# EAGLE design ALU (EAGLE 9.5.2)
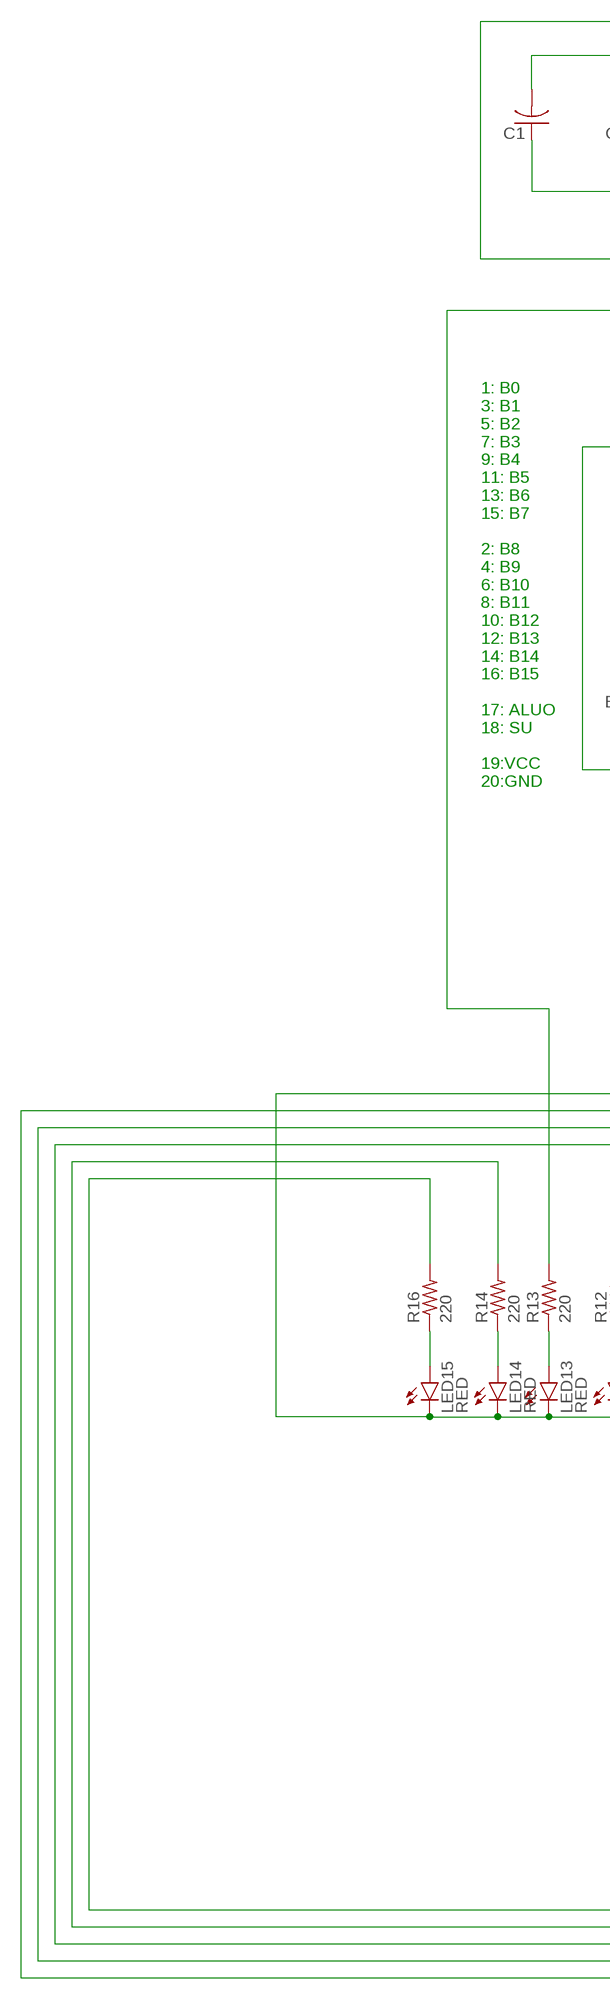
[diagram p0: schematic, sheet 1, part 1 of 2]
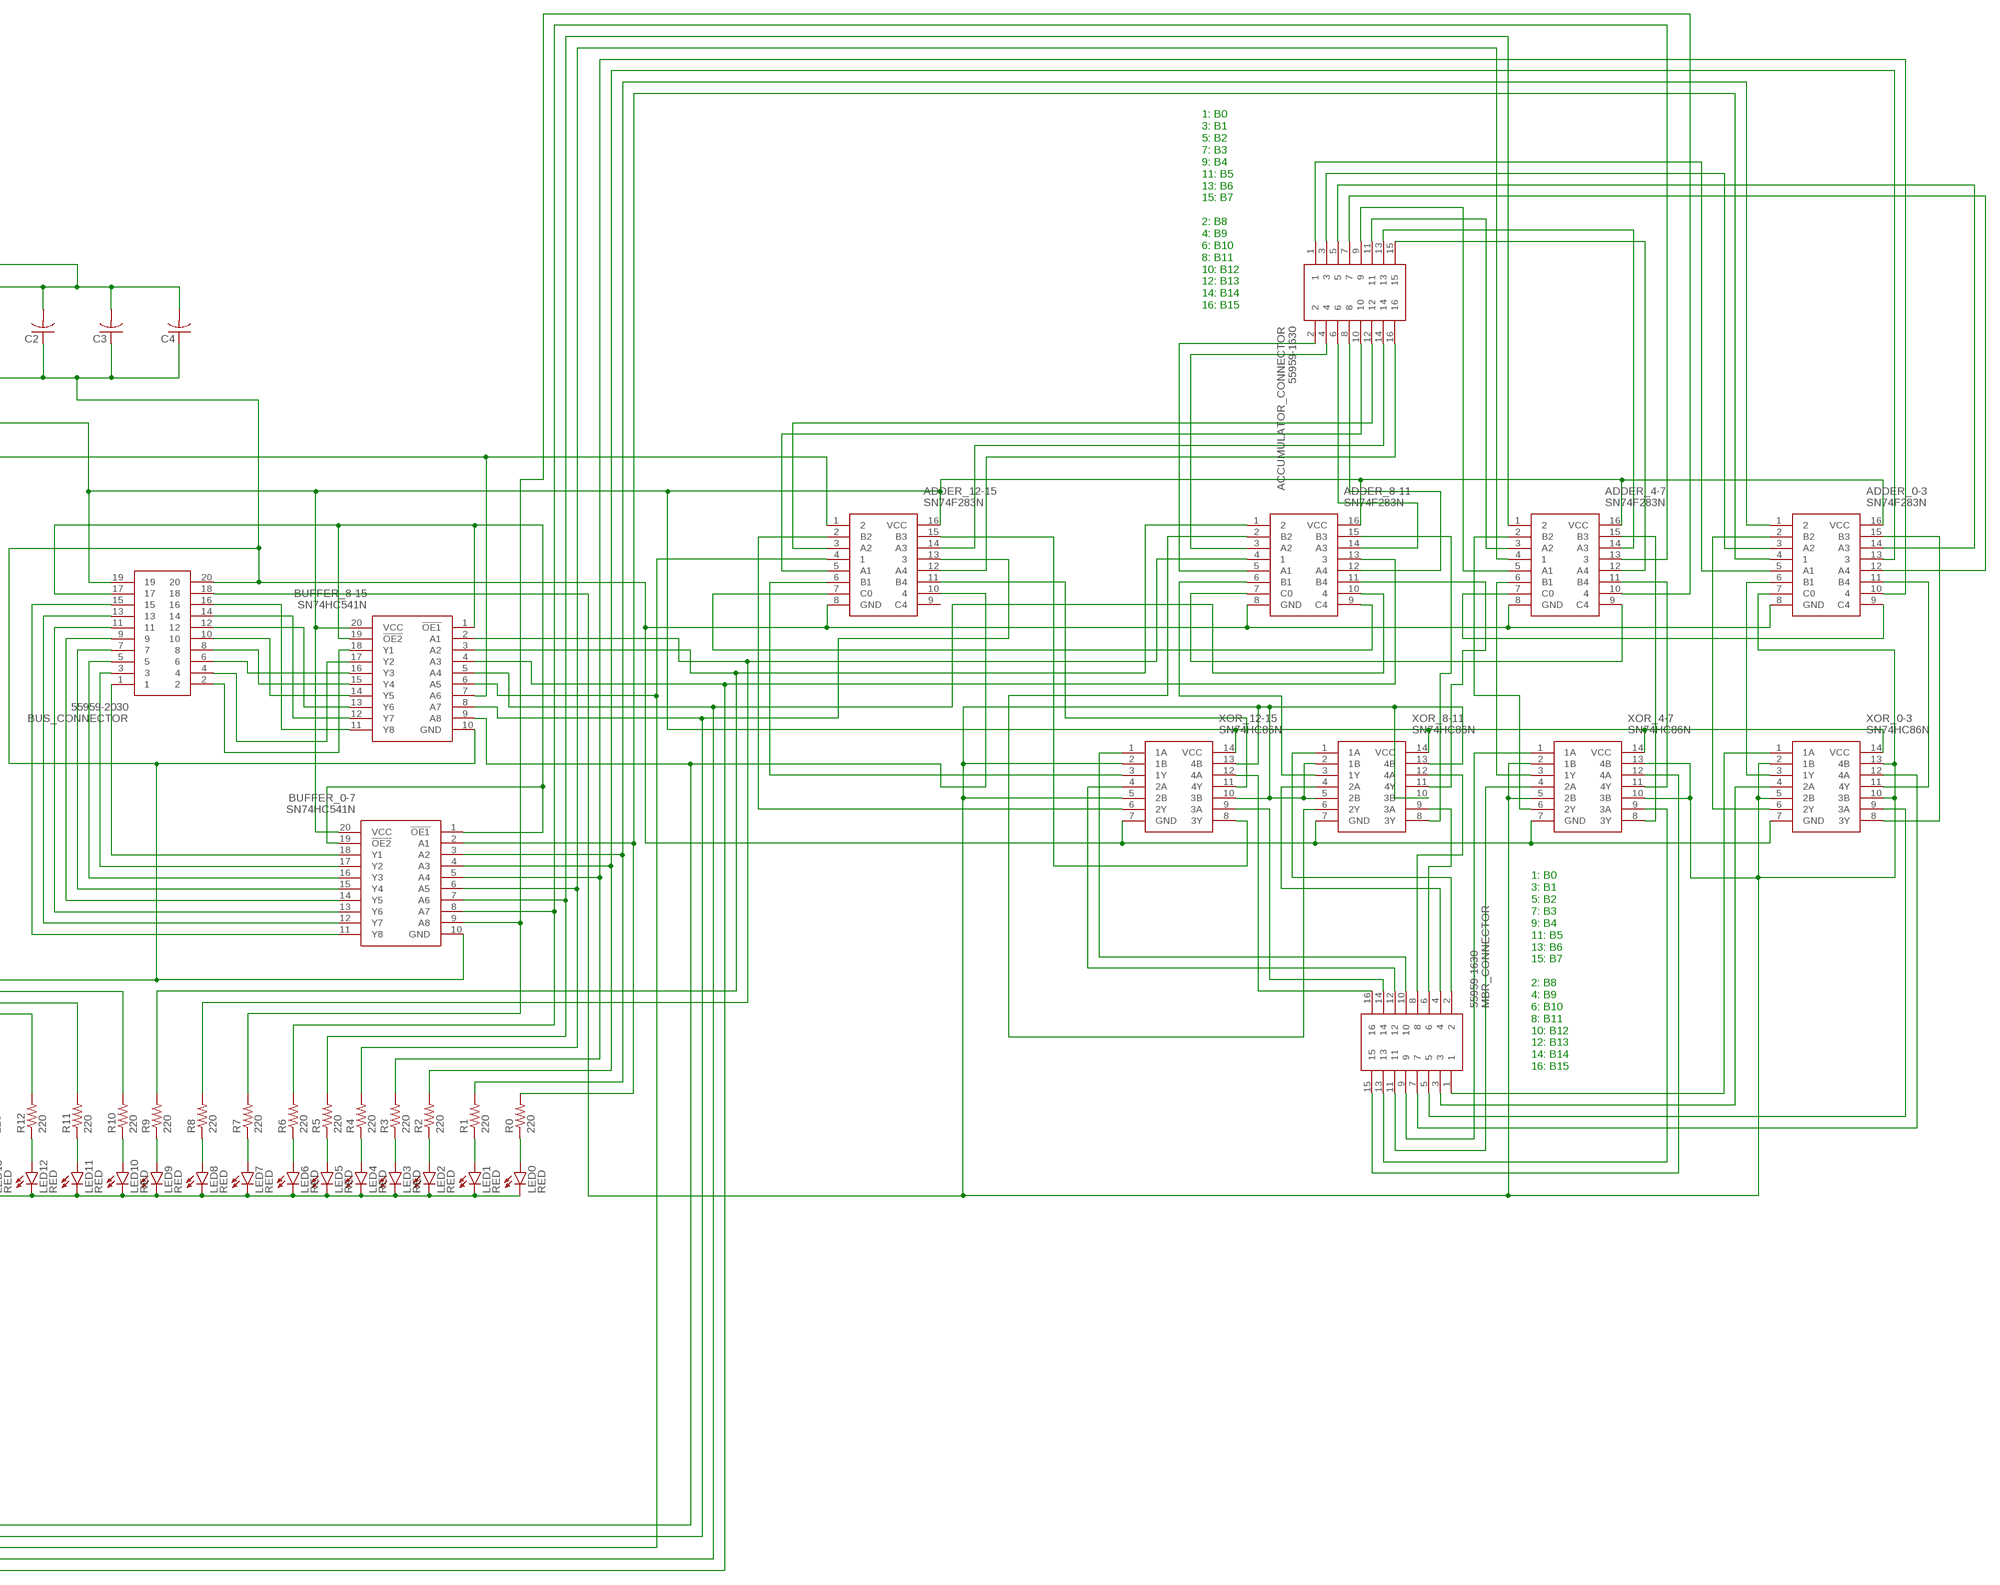
[diagram p1: schematic, sheet 1, part 2 of 2]

## Parts
ACCUMULATOR_CONNECTOR  55959-1630  [SHDR16W65P250X200_2X8_1940X140]
ADDER_0-3  SN74F283N  [DIP254P762X508-16]
ADDER_4-7  SN74F283N  [DIP254P762X508-16]
ADDER_8-11  SN74F283N  [DIP254P762X508-16]
ADDER_12-15  SN74F283N  [DIP254P762X508-16]
BUFFER_0-7  SN74HC541N  [DIP794W53P254L2540H508Q20N]
BUFFER_8-15  SN74HC541N  [DIP794W53P254L2540H508Q20N]
BUS_CONNECTOR  55959-2030  [55959-2030_1]
C1  C-US025-024X044  [C025-024X044]
C2  C-US025-024X044  [C025-024X044]
C3  C-US025-024X044  [C025-024X044]
C4  C-US025-024X044  [C025-024X044]
LED0  RED  LED3MM  [LED3MM]
LED1  RED  LED3MM  [LED3MM]
LED2  RED  LED3MM  [LED3MM]
LED3  RED  LED3MM  [LED3MM]
LED4  RED  LED3MM  [LED3MM]
LED5  RED  LED3MM  [LED3MM]
LED6  RED  LED3MM  [LED3MM]
LED7  RED  LED3MM  [LED3MM]
LED8  RED  LED3MM  [LED3MM]
LED9  RED  LED3MM  [LED3MM]
LED10  RED  LED3MM  [LED3MM]
LED11  RED  LED3MM  [LED3MM]
LED12  RED  LED3MM  [LED3MM]
LED13  RED  LED3MM  [LED3MM]
LED14  RED  LED3MM  [LED3MM]
LED15  RED  LED3MM  [LED3MM]
MBR_CONNECTOR  55959-1630  [SHDR16W65P250X200_2X8_1940X140]
R0  220  R-US_0204/7  [0204/7]
R1  220  R-US_0204/7  [0204/7]
R2  220  R-US_0204/7  [0204/7]
R3  220  R-US_0204/7  [0204/7]
R4  220  R-US_0204/7  [0204/7]
R5  220  R-US_0204/7  [0204/7]
R6  220  R-US_0204/7  [0204/7]
R7  220  R-US_0204/7  [0204/7]
R8  220  R-US_0204/7  [0204/7]
R9  220  R-US_0204/7  [0204/7]
R10  220  R-US_0204/7  [0204/7]
R11  220  R-US_0204/7  [0204/7]
R12  220  R-US_0204/7  [0204/7]
R13  220  R-US_0204/7  [0204/7]
R14  220  R-US_0204/7  [0204/7]
R16  220  R-US_0204/7  [0204/7]
XOR_0-3  SN74HC86N  [DIP794W53P254L1930H508Q14N]
XOR_4-7  SN74HC86N  [DIP794W53P254L1930H508Q14N]
XOR_8-11  SN74HC86N  [DIP794W53P254L1930H508Q14N]
XOR_12-15  SN74HC86N  [DIP794W53P254L1930H508Q14N]

## Nets
N$1: MBR_CONNECTOR.1 XOR_0-3.1(1A)
N$2: MBR_CONNECTOR.3 XOR_0-3.4(2A)
N$3: MBR_CONNECTOR.5 XOR_0-3.9(3A)
N$4: MBR_CONNECTOR.7 XOR_0-3.12(4A)
N$5: MBR_CONNECTOR.9 XOR_4-7.1(1A)
N$6: MBR_CONNECTOR.11 XOR_4-7.4(2A)
N$7: MBR_CONNECTOR.13 XOR_4-7.9(3A)
N$8: MBR_CONNECTOR.15 XOR_4-7.12(4A)
N$9: ADDER_0-3.6(B1) XOR_0-3.3(1Y)
N$10: ADDER_0-3.2(B2) XOR_0-3.6(2Y)
N$11: ADDER_0-3.15(B3) XOR_0-3.8(3Y)
N$12: ADDER_0-3.11(B4) XOR_0-3.11(4Y)
N$13: MBR_CONNECTOR.16 XOR_12-15.12(4A)
N$14: MBR_CONNECTOR.14 XOR_12-15.9(3A)
N$15: MBR_CONNECTOR.12 XOR_12-15.4(2A)
N$16: MBR_CONNECTOR.10 XOR_12-15.1(1A)
N$17: ADDER_4-7.9(C4) ADDER_8-11.7(C0)
N$18: ADDER_8-11.9(C4) ADDER_12-15.7(C0)
N$19: ADDER_0-3.9(C4) ADDER_4-7.7(C0)
N$20: MBR_CONNECTOR.8 XOR_8-11.12(4A)
N$21: MBR_CONNECTOR.6 XOR_8-11.9(3A)
N$22: MBR_CONNECTOR.4 XOR_8-11.4(2A)
N$23: MBR_CONNECTOR.2 XOR_8-11.1(1A)
N$24: ADDER_4-7.6(B1) XOR_4-7.3(1Y)
N$25: ADDER_4-7.2(B2) XOR_4-7.6(2Y)
N$26: ADDER_4-7.15(B3) XOR_4-7.8(3Y)
N$27: ADDER_4-7.11(B4) XOR_4-7.11(4Y)
N$28: ACCUMULATOR_CONNECTOR.2 ADDER_8-11.5(A1)
N$29: ADDER_8-11.2(B2) XOR_8-11.6(2Y)
N$30: ADDER_8-11.15(B3) XOR_8-11.8(3Y)
N$31: ADDER_8-11.11(B4) XOR_8-11.11(4Y)
N$32: ACCUMULATOR_CONNECTOR.15 ADDER_4-7.12(A4)
N$33: ACCUMULATOR_CONNECTOR.13 ADDER_4-7.14(A3)
N$34: ACCUMULATOR_CONNECTOR.11 ADDER_4-7.3(A2)
N$35: ACCUMULATOR_CONNECTOR.9 ADDER_4-7.5(A1)
N$36: ACCUMULATOR_CONNECTOR.7 ADDER_0-3.12(A4)
N$37: ACCUMULATOR_CONNECTOR.5 ADDER_0-3.14(A3)
N$38: ACCUMULATOR_CONNECTOR.3 ADDER_0-3.3(A2)
N$39: ACCUMULATOR_CONNECTOR.1 ADDER_0-3.5(A1)
N$40: ADDER_8-11.6(B1) XOR_8-11.3(1Y)
N$41: ACCUMULATOR_CONNECTOR.4 ADDER_8-11.3(A2)
N$42: ACCUMULATOR_CONNECTOR.6 ADDER_8-11.14(A3)
N$43: ACCUMULATOR_CONNECTOR.8 ADDER_8-11.12(A4)
N$44: ACCUMULATOR_CONNECTOR.10 ADDER_12-15.5(A1)
N$45: ACCUMULATOR_CONNECTOR.12 ADDER_12-15.3(A2)
N$46: ACCUMULATOR_CONNECTOR.14 ADDER_12-15.14(A3)
N$47: ACCUMULATOR_CONNECTOR.16 ADDER_12-15.12(A4)
N$48: ADDER_12-15.2(B2) XOR_12-15.6(2Y)
N$49: ADDER_12-15.6(B1) XOR_12-15.3(1Y)
N$50: ADDER_12-15.15(B3) XOR_12-15.8(3Y)
N$51: ADDER_12-15.11(B4) XOR_12-15.11(4Y)
N$52: ADDER_0-3.8(GND) ADDER_4-7.8(GND) ADDER_8-11.8(GND) ADDER_12-15.8(GND) BUFFER_0-7.10(GND) BUFFER_8-15.10(GND) BUS_CONNECTOR.20 C1.1 C2.1 C3.1 C4.1 LED0.K(C) LED1.K(C) LED2.K(C) LED3.K(C) LED4.K(C) LED5.K(C) LED6.K(C) LED7.K(C) LED8.K(C) LED9.K(C) LED10.K(C) LED11.K(C) LED12.K(C) LED13.K(C) LED14.K(C) LED15.K(C) XOR_0-3.7(GND) XOR_4-7.7(GND) XOR_8-11.7(GND) XOR_12-15.7(GND)
N$53: BUFFER_0-7.18(Y1) BUS_CONNECTOR.1
N$54: ADDER_0-3.16(VCC) ADDER_4-7.16(VCC) ADDER_8-11.16(VCC) ADDER_12-15.16(VCC) BUFFER_0-7.20(VCC) BUFFER_8-15.20(VCC) BUS_CONNECTOR.19 C1.2 C2.2 C3.2 C4.2 XOR_0-3.14(VCC) XOR_4-7.14(VCC) XOR_8-11.14(VCC) XOR_12-15.14(VCC)
N$55: BUFFER_0-7.17(Y2) BUS_CONNECTOR.3
N$56: BUFFER_0-7.16(Y3) BUS_CONNECTOR.5
N$57: BUFFER_0-7.15(Y4) BUS_CONNECTOR.7
N$58: BUFFER_0-7.14(Y5) BUS_CONNECTOR.9
N$59: BUFFER_0-7.13(Y6) BUS_CONNECTOR.11
N$60: BUFFER_0-7.12(Y7) BUS_CONNECTOR.13
N$61: BUFFER_0-7.11(Y8) BUS_CONNECTOR.15
N$62: BUFFER_8-15.15(Y4) BUS_CONNECTOR.8
N$63: BUFFER_8-15.16(Y3) BUS_CONNECTOR.6
N$64: BUFFER_8-15.11(Y8) BUS_CONNECTOR.16
N$65: BUFFER_8-15.12(Y7) BUS_CONNECTOR.14
N$66: BUFFER_8-15.13(Y6) BUS_CONNECTOR.12
N$67: BUFFER_8-15.14(Y5) BUS_CONNECTOR.10
N$68: BUFFER_8-15.17(Y2) BUS_CONNECTOR.4
N$69: BUFFER_8-15.18(Y1) BUS_CONNECTOR.2
N$70: BUFFER_0-7.1(!OE1) BUFFER_0-7.19(!OE2) BUFFER_8-15.1(!OE1) BUFFER_8-15.19(!OE2) BUS_CONNECTOR.17
N$71: ADDER_0-3.4 BUFFER_0-7.2(A1) R0.2
N$72: ADDER_0-3.7(C0) BUS_CONNECTOR.18 XOR_0-3.2(1B) XOR_0-3.5(2B) XOR_0-3.10(3B) XOR_0-3.13(4B) XOR_4-7.2(1B) XOR_4-7.5(2B) XOR_4-7.10(3B) XOR_4-7.13(4B) XOR_8-11.2(1B) XOR_8-11.5(2B) XOR_8-11.10(3B) XOR_8-11.13(4B) XOR_12-15.2(1B) XOR_12-15.5(2B) XOR_12-15.10(3B) XOR_12-15.13(4B)
N$73: ADDER_0-3.1 BUFFER_0-7.3(A2) R1.2
N$74: ADDER_0-3.13 BUFFER_0-7.4(A3) R2.2
N$75: ADDER_0-3.10 BUFFER_0-7.5(A4) R3.2
N$76: ADDER_4-7.4 BUFFER_0-7.6(A5) R4.2
N$77: ADDER_4-7.1 BUFFER_0-7.7(A6) R5.2
N$78: ADDER_4-7.13 BUFFER_0-7.8(A7) R6.2
N$79: ADDER_4-7.10 BUFFER_0-7.9(A8) R7.2
N$80: ADDER_8-11.4 BUFFER_8-15.2(A1) R8.2
N$81: ADDER_8-11.1 BUFFER_8-15.3(A2) R9.2
N$82: ADDER_8-11.13 BUFFER_8-15.4(A3) R10.2
N$83: ADDER_8-11.10 BUFFER_8-15.5(A4) R11.2
N$84: ADDER_12-15.4 BUFFER_8-15.6(A5) R12.2
N$85: ADDER_12-15.1 BUFFER_8-15.7(A6) R13.2
N$86: ADDER_12-15.10 BUFFER_8-15.9(A8) R16.2
N$87: LED15.A R16.1
N$88: ADDER_12-15.13 BUFFER_8-15.8(A7) R14.2
N$89: LED14.A R14.1
N$90: LED13.A R13.1
N$91: LED12.A R12.1
N$92: LED11.A R11.1
N$93: LED10.A R10.1
N$94: LED9.A R9.1
N$95: LED8.A R8.1
N$96: LED7.A R7.1
N$97: LED6.A R6.1
N$98: LED5.A R5.1
N$99: LED4.A R4.1
N$100: LED3.A R3.1
N$101: LED2.A R2.1
N$102: LED1.A R1.1
N$103: LED0.A R0.1
Unconnected: ADDER_12-15.9(C4)

## Notes on the sheet
- 1: B0
  3: B1
  5: B2
  7: B3
  9: B4
  11: B5
  13: B6
  15: B7
  
  2: B8
  4: B9
  6: B10
  8: B11
  10: B12
  12: B13
  14: B14
  16: B15
- 1: B0
  3: B1
  5: B2
  7: B3
  9: B4
  11: B5
  13: B6
  15: B7
  
  2: B8
  4: B9
  6: B10
  8: B11
  10: B12
  12: B13
  14: B14
  16: B15
  
  17: ALUO
  18: SU
  
  19:VCC
  20:GND
- 1: B0
  3: B1
  5: B2
  7: B3
  9: B4
  11: B5
  13: B6
  15: B7
  
  2: B8
  4: B9
  6: B10
  8: B11
  10: B12
  12: B13
  14: B14
  16: B15

## Library data of the parts
ACCUMULATOR_CONNECTOR MBR_CONNECTOR = SamacSys_Parts:55959-1630: Molex MICROCLASP Series, Series Number 55959, 2mm Pitch 16 Way 2 Row Right Angle PCB Header, Solder Termination, 3A Source: Datasheet <https://componentsearchengine.com/Datasheets/1/55959-1630.pdf>; DESCRIPTION: Molex MICROCLASP Series, Series Number 55959, 2mm Pitch 16 Way 2 Row Right Angle PCB Header, Solder Termination, 3A; HEIGHT: 11.7mm; MANUFACTURER_NAME: Molex; MANUFACTURER_PART_NUMBER: 55959-1630; MOUSER_PART_NUMBER: 538-55959-1630; MOUSER_PRICE-STOCK: https://www.mouser.com/Search/Refine.aspx?Keyword=538-55959-1630
ADDER_0-3 ADDER_4-7 ADDER_8-11 ADDER_12-15 = SamacSys_Parts:SN74F283N: 4 BIT BINARY FULL ADDERS WITH FAST CARRY Source: Datasheet <http://www.ti.com/lit/gpn/sn74f283>; DESCRIPTION: 4 BIT BINARY FULL ADDERS WITH FAST CARRY; HEIGHT: mm; MANUFACTURER_NAME: Texas Instruments; MANUFACTURER_PART_NUMBER: SN74F283N; MOUSER_PART_NUMBER: 595-SN74F283N; MOUSER_PRICE-STOCK: https://www.mouser.com/Search/Refine.aspx?Keyword=595-SN74F283N
BUFFER_0-7 BUFFER_8-15 = SamacSys_Parts:SN74HC541N: Octal Buffers And Line Drivers With 3-State Outputs Source: Datasheet <http://componentsearchengine.com/Datasheets/3/SN74HC541N.pdf>; DESCRIPTION: Octal Buffers And Line Drivers With 3-State Outputs; HEIGHT: 5.08mm; MANUFACTURER_NAME: Texas Instruments; MANUFACTURER_PART_NUMBER: SN74HC541N; MOUSER_PART_NUMBER: 595-SN74HC541N; MOUSER_PRICE-STOCK: https://www.mouser.com/Search/Refine.aspx?Keyword=595-SN74HC541N
BUS_CONNECTOR = SamacSys_Parts:55959-2030: Molex MICROCLASP Series, Series Number 56134, 2mm Pitch 20 Way 2 Row Right Angle PCB Header, Solder Termination, 3A Source: Datasheet <https://componentsearchengine.com/Datasheets/1/55959-2030.pdf>; DESCRIPTION: Molex MICROCLASP Series, Series Number 56134, 2mm Pitch 20 Way 2 Row Right Angle PCB Header, Solder Termination, 3A; HEIGHT: mm; MANUFACTURER_NAME: Molex; MANUFACTURER_PART_NUMBER: 55959-2030; MOUSER_PART_NUMBER: 538-55959-2030; MOUSER_PRICE-STOCK: https://www.mouser.com/Search/Refine.aspx?Keyword=538-55959-2030
C1-C4 = rcl:C-US: CAPACITOR, American symbol; SPICEPREFIX: C
LED0 LED1-LED15 = led:LED: LED OSRAM: - CHIPLED LG R971, LG N971, LY N971, LG Q971, LY Q971, LO R971, LY R971 LH N974, LH R974 LS Q976, LO Q976, LY Q976 LO Q996 - Hyper CHIPLED LW Q18S LB Q993, LB Q99A, LB R99A - SideLED LS A670, LO A670, LY A670, LG A670, LP A670 LB A673, LV A673, LT A673, LW A673 LH A674 LY A675 LS A676, LA A676, LO A676, LY A676, LW A676 LS A679, LY A679, LG A679 - Hyper Micro SIDELED® LS Y876, LA Y876, LO Y876, LY Y876 LT Y87S - SmartLED LW L88C, LW L88S LB L89C, LB L89S, LG L890 LS L89K, LO L89K, LY L89K LS L896, LA L896, LO L896, LY L896 - TOPLED LS T670, LO T670, LY T670, LG T670, LP T670 LSG T670, LSP T670, LSY T670, LOP T670, LYG T670 LG T671, LOG T671, LSG T671 LB T673, LV T673, LT T673, LW T673 LH T674 LS T676, LA T676, LO T676, LY T676, LB T676, LH T676, LSB T676, LW T676 LB T67C, LV T67C, LT T67C, LS T67K, LO T67K, LY T67K, LW E67C LS E67B, LA E67B, LO E67B, LY E67B, LB E67C, LV E67C, LT E67C LW T67C LS T679, LY T679, LG T679 LS T770, LO T770, LY T770, LG T770, LP T770 LB T773, LV T773, LT T773, LW T773 LH T774 LS E675, LA E675, LY E675, LS T675 LS T776, LA T776, LO T776, LY T776, LB T776 LHGB T686 LT T68C, LB T68C - Hyper Mini TOPLED® LB M676 - Mini TOPLED Santana® LG M470 LS M47K, LO M47K, LY M47K Source: http://www.osram.convergy.de LUXEON: - LUMILED® LXK2-PW12-R00, LXK2-PW12-S00, LXK2-PW14-U00, LXK2-PW14-V00 LXK2-PM12-R00, LXK2-PM12-S00, LXK2-PM14-U00 LXK2-PE12-Q00, LXK2-PE12-R00, LXK2-PE12-S00, LXK2-PE14-T00, LXK2-PE14-U00 LXK2-PB12-K00, LXK2-PB12-L00, LXK2-PB12-M00, LXK2-PB14-N00, LXK2-PB14-P00, LXK2-PB14-Q00 LXK2-PR12-L00, LXK2-PR12-M00, LXK2-PR14-Q00, LXK2-PR14-R00 LXK2-PD12-Q00, LXK2-PD12-R00, LXK2-PD12-S00 LXK2-PH12-R00, LXK2-PH12-S00 LXK2-PL12-P00, LXK2-PL12-Q00, LXK2-PL12-R00 Source: www.luxeon.com KINGBRIGHT: KA-3528ASYC Source: www.kingbright.com
R0 R1-R14 R16 = rcl:R-US_: RESISTOR, American symbol; SPICEPREFIX: R
XOR_0-3 XOR_4-7 XOR_8-11 XOR_12-15 = SamacSys_Parts:SN74HC86N: QUADRUPLE 2-INPUT EXCLUSIVE-OR GATES Source: Datasheet <http://componentsearchengine.com/Datasheets/1/SN74HC86N.pdf>; DESCRIPTION: QUADRUPLE 2-INPUT EXCLUSIVE-OR GATES; HEIGHT: 5.08mm; MANUFACTURER_NAME: Texas Instruments; MANUFACTURER_PART_NUMBER: SN74HC86N; MOUSER_PART_NUMBER: 595-SN74HC86N; MOUSER_PRICE-STOCK: https://www.mouser.com/Search/Refine.aspx?Keyword=595-SN74HC86N

## Board
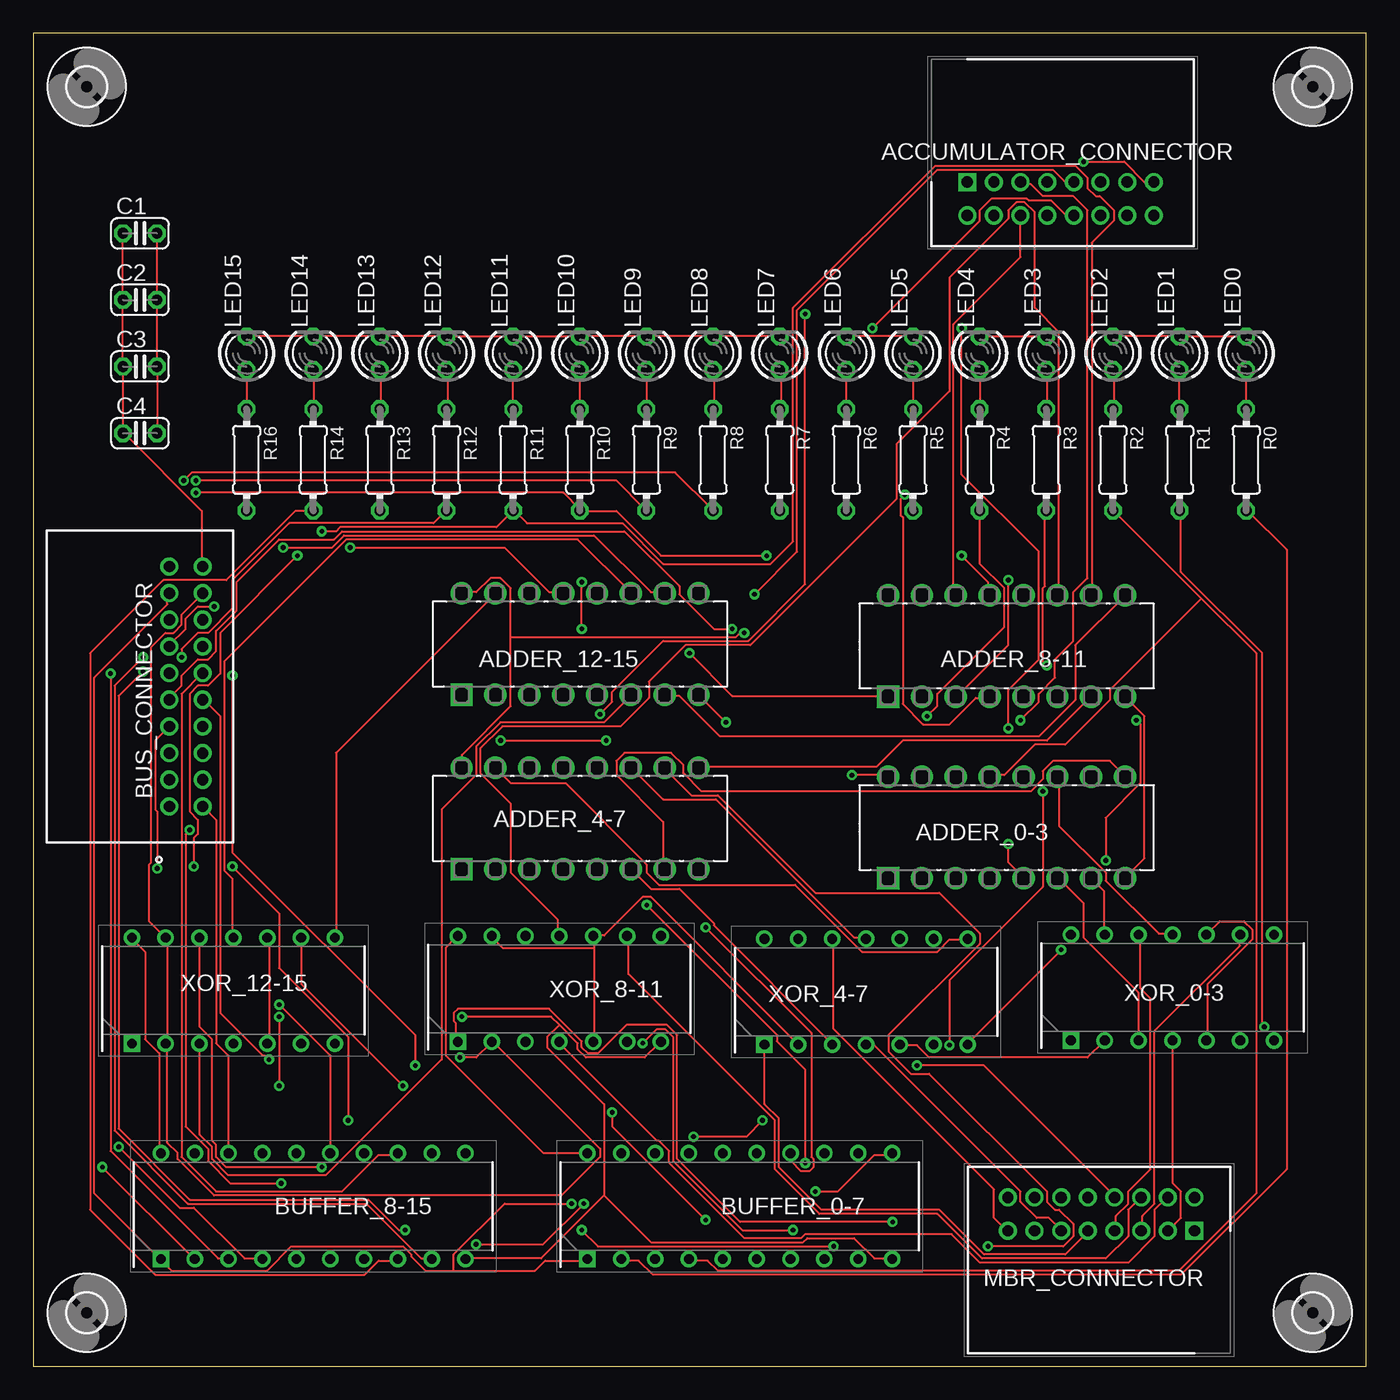
[diagram p2: board, top side]
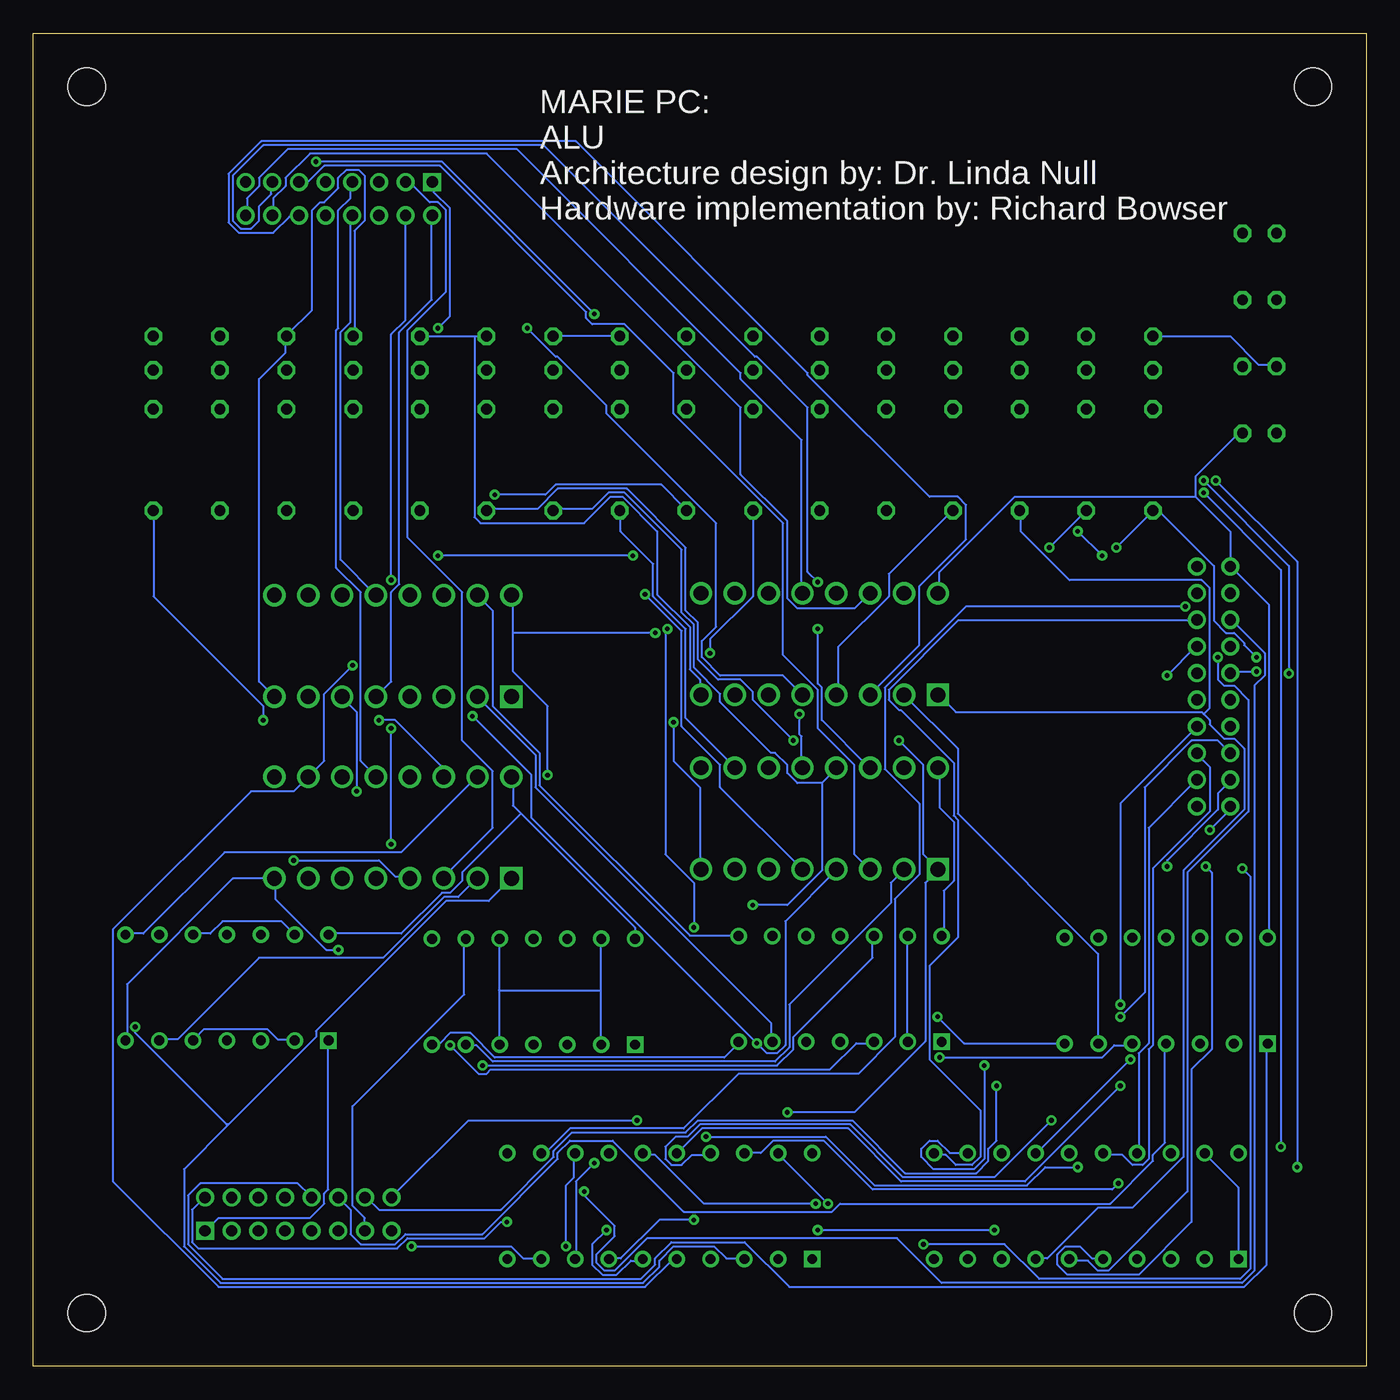
[diagram p3: board, bottom side, seen from below]

Size 100 x 100 mm. Coordinates in mm from the lower left corner, seen from the top.
Outline: 0,0 100,0 100,100 0,100 0,0
Copper layers (1*16): Top 0.035mm / dielectric 1.5mm / Bottom 0.035mm
Design rules "default": minimum track width 6mil, minimum drill 0.35mm, track to track 6mil, track to pad 6mil, pad to pad 6mil, via to via 6mil, smd to smd 6mil, copper to edge 40mil, drill to drill 6mil, minimum pad ring 10mil, minimum via ring 8mil, stop-mask expansion 4mil, vias tented up to drill 0mil, thermal gap 10mil

### Footprints (pad centres in the part's own frame; a part is rotated, then mirrored left to right if it is on the bottom)
SHDR16W65P250X200_2X8_1940X140 = drill 0.85 pad 1.275 square: 1 0,0 | drill 0.85 pad 1.275: 2 0,2.5; 3 -2,0; 4 -2,2.5; 5 -4,0; 6 -4,2.5; 7 -6,0; 8 -6,2.5; 9 -8,0; 10 -8,2.5; 11 -10,0; 12 -10,2.5; 13 -12,0; 14 -12,2.5; 15 -14,0; 16 -14,2.5
DIP254P762X508-16 = drill 1.118 pad 1.676 square: 1 -7.62,17.78 | drill 1.118 pad 1.676: 2 -7.62,15.24; 3 -7.62,12.7; 4 -7.62,10.16; 5 -7.62,7.62; 6 -7.62,5.08; 7 -7.62,2.54; 8 -7.62,0; 9 0,0; 10 0,2.54; 11 0,5.08; 12 0,7.62; 13 0,10.16; 14 0,12.7; 15 0,15.24; 16 0,17.78
DIP794W53P254L2540H508Q20N = drill 0.73 pad 1.13 square: 1 -3.97,11.43 | drill 0.73 pad 1.13: 2 -3.97,8.89; 3 -3.97,6.35; 4 -3.97,3.81; 5 -3.97,1.27; 6 -3.97,-1.27; 7 -3.97,-3.81; 8 -3.97,-6.35; 9 -3.97,-8.89; 10 -3.97,-11.43; 11 3.97,-11.43; 12 3.97,-8.89; 13 3.97,-6.35; 14 3.97,-3.81; 15 3.97,-1.27; 16 3.97,1.27; 17 3.97,3.81; 18 3.97,6.35; 19 3.97,8.89; 20 3.97,11.43
55959-2030_1 = drill 0.85 pad 1.35: 1 -9,-9.2; 2 -9,-11.7; 3 -7,-9.2; 4 -7,-11.7; 5 -5,-9.2; 6 -5,-11.7; 7 -3,-9.2; 8 -3,-11.7; 9 -1,-9.2; 10 -1,-11.7; 11 1,-9.2; 12 1,-11.7; 13 3,-9.2; 14 3,-11.7; 15 5,-9.2; 16 5,-11.7; 17 7,-9.2; 18 7,-11.7; 19 9,-9.2; 20 9,-11.7
C025-024X044 = drill 0.813 octagon: 1 -1.27,0; 2 1.27,0
LED3MM = drill 0.813 octagon: A -1.27,0; K 1.27,0
0204/7 = drill 0.813 octagon: 1 -3.81,0; 2 3.81,0
2,8 = hole 2.8: 0,0
DIP794W53P254L1930H508Q14N = drill 0.73 pad 1.13 square: 1 -3.97,7.62 | drill 0.73 pad 1.13: 2 -3.97,5.08; 3 -3.97,2.54; 4 -3.97,0; 5 -3.97,-2.54; 6 -3.97,-5.08; 7 -3.97,-7.62; 8 3.97,-7.62; 9 3.97,-5.08; 10 3.97,-2.54; 11 3.97,0; 12 3.97,2.54; 13 3.97,5.08; 14 3.97,7.62

### Placement (x,y rotation side)
ACCUMULATOR_CONNECTOR  70.07,88.84 180 top
ADDER_0-3  81.91,44.22 90 top
ADDER_4-7  49.91,44.9 90 top
ADDER_8-11  81.91,57.85 90 top
ADDER_12-15  49.91,57.99 90 top
BUFFER_0-7  53,12 90 top
BUFFER_8-15  21,12 90 top
BUS_CONNECTOR  1,51 90 top
C1  8,85 0 top
C2  8,80 0 top
C3  8,75 0 top
C4  8,70 0 top
LED0  91,76 90 top
LED1  86,76 90 top
LED2  81,76 90 top
LED3  76,76 90 top
LED4  71,76 90 top
LED5  66,76 90 top
LED6  61,76 90 top
LED7  56,76 90 top
LED8  51,76 90 top
LED9  46,76 90 top
LED10  41,76 90 top
LED11  36,76 90 top
LED12  31,76 90 top
LED13  26,76 90 top
LED14  21,76 90 top
LED15  16,76 90 top
MBR_CONNECTOR  87.12,10.16 0 top
R0  91,68 270 top
R1  86,68 270 top
R2  81,68 270 top
R3  76,68 270 top
R4  71,68 270 top
R5  66,68 270 top
R6  61,68 270 top
R7  56,68 270 top
R8  51,68 270 top
R9  46,68 270 top
R10  41,68 270 top
R11  36,68 270 top
R12  31,68 270 top
R13  26,68 270 top
R14  21,68 270 top
R16  16,68 270 top
U$1  [2,8]  4,4 0 top
U$2  [2,8]  4,96 0 top
U$3  [2,8]  96,96 0 top
U$4  [2,8]  96,4 0 top
XOR_0-3  85.47,28.41 90 top
XOR_4-7  62.47,28.09 90 top
XOR_8-11  39.47,28.31 90 top
XOR_12-15  15.01,28.18 90 top

### Tracks (layer width: path | path; a pad name or v marks a point on that pad's centre or on a via)
N$1
  Bottom 0.152: XOR_0-3.1 77.88,24.38 77.88,13.26 78.18,12.95 78.18,12.19 79.25,11.12 86.11,11.12 87.02,10.21 MBR_CONNECTOR.1
N$2
  Top 0.152: XOR_0-3.4 85.5,24.38 85.5,13.72 86.11,13.11 86.11,11.12 85.19,10.21 MBR_CONNECTOR.3
N$3
  Top 0.152: XOR_0-3.9 90.53,32.31 90.53,31.55 84.12,25.15 84.12,12.19 83.21,11.28 83.21,10.21 MBR_CONNECTOR.5
N$4
  Top 0.152: XOR_0-3.12 83.06,32.31 83.06,28.35 83.82,27.58 83.82,14.78 82.14,13.11 82.14,12.19 81.23,11.28 81.23,10.21 MBR_CONNECTOR.7
N$5
  Top 0.152: XOR_4-7.1 54.86,24.08 54.86,19.66 55.93,18.59 55.93,14.94 59.13,11.73 67.97,11.73 71.32,8.38 77.42,8.38 79.1,10.06 MBR_CONNECTOR.9
N$6
  Top 0.152: XOR_4-7.4 62.48,24.08 63.09,24.08 74.07,13.11 74.07,12.34 75.29,11.12 76.2,11.12 77.11,10.21 MBR_CONNECTOR.11
N$7
  Bottom 0.152: XOR_4-7.9 67.67,32 67.67,27.89 76.05,19.51 76.05,12.04 75.13,11.12 75.13,10.21 MBR_CONNECTOR.13
N$8
  Top 0.152: XOR_4-7.12 60.05,32 60.05,25.3 72.08,13.26 72.08,11.12 73,10.21 MBR_CONNECTOR.15
N$9
  Top 0.152: XOR_0-3.3 82.91,24.54 82.91,28.04 78.79,32.16 78.79,34.75 76.96,36.58 ADDER_0-3.6
N$10
  Bottom 0.152: XOR_0-3.6 90.53,24.54 89.15,24.54 83.06,30.63 73.76,30.63 69.19,35.2 68.12,35.2 66.75,36.58 ADDER_0-3.2
N$11
  Bottom 0.152: XOR_0-3.8 92.96,32.46 91.75,32.46 85.65,38.56 72.39,38.56 66.75,44.2 ADDER_0-3.15
N$12
  Top 0.152: XOR_0-3.11 85.34,32.46 84.43,32.46 80.47,36.42 80.47,37.03 76.96,40.54 76.96,44.2 ADDER_0-3.11
N$13  (via drill 0.35)
  Top 0.152: v21.64,14.94 14.48,14.94 13.72,15.7 13.72,16.61 13.41,16.92 13.41,24.54 12.5,25.45 12.5,32 XOR_12-15.12 | v49.53,17.22 53.49,17.22 v54.71,18.44
  Bottom 0.152: v21.64,14.94 24.08,14.94 25.45,13.56 36.88,13.56 40.54,17.22 v49.53,17.22 | v54.71,18.44 67.36,18.44 73,12.8 MBR_CONNECTOR.16
N$14  (via drill 0.35)
  Top 0.152: v27.74,21.03 20.12,28.65 20.12,32 XOR_12-15.9
  Bottom 0.152: v27.74,21.03 27.74,16.92 28.35,16.31 28.35,15.39 29.26,14.48 34.59,14.48 38.56,18.44 50.14,18.44 51.05,17.53 59.59,17.53 60.96,16.15 60.96,15.7 64.92,11.73 74.07,11.73 74.98,12.65 MBR_CONNECTOR.14
N$15
  Bottom 0.152: XOR_12-15.4 15.09,24.08 15.09,16.76 16,15.85 16,15.39 19.2,12.19 39.47,12.19 40.08,11.58 51.21,11.58 56.54,16.92 59.74,16.92 60.66,16 60.66,15.54 66.29,9.91 72.08,9.91 72.85,9.14 75.44,9.14 76.2,9.91 76.2,11.73 77.11,12.65 MBR_CONNECTOR.12
N$16
  Bottom 0.152: XOR_12-15.1 7.47,24.08 7.47,7.62 9.14,5.94 43.28,5.94 46.63,9.3 52.12,9.3 53.34,8.08 53.34,7.62 54.41,6.55 85.8,6.55 88.39,9.14 88.39,12.8 87.48,13.72 80.16,13.72 79.25,12.8 MBR_CONNECTOR.10
N$17
  Top 0.152: ADDER_4-7.9 49.99,44.96 63.25,44.96 65.23,46.94 76.05,46.94 79.25,50.14 ADDER_8-11.7
N$18
  Top 0.152: ADDER_12-15.7 47.4,50.29 48.46,50.29 51.51,47.24 75.44,47.24 78.18,49.99 78.18,54.1 81.84,57.76 ADDER_8-11.9
N$19
  Top 0.152: ADDER_4-7.7 47.24,37.34 47.24,40.84 43.74,44.35 43.74,45.41 44.35,46.02 47.85,46.02 48.77,45.11 48.77,44.5 50.14,43.13 74.83,43.13 75.74,44.04 75.74,44.65 76.5,45.41 80.77,45.41 81.84,44.35 ADDER_0-3.9
N$20  (via drill 0.35)
  Top 0.152: v66.29,22.55 71.32,22.55 81.08,12.8 MBR_CONNECTOR.8
  Bottom 0.152: v66.29,22.55 44.2,22.55 42.98,23.77 42.98,24.69 37.03,30.63 37.03,32.16 XOR_8-11.12
N$21
  Top 0.152: XOR_8-11.9 44.65,32.16 44.65,29.41 55.63,18.44 55.63,14.78 58.98,11.43 67.82,11.43 71.17,8.08 80.47,8.08 82.14,9.75 82.14,11.73 83.06,12.65 MBR_CONNECTOR.6
N$22
  Top 0.152: XOR_8-11.4 39.47,24.23 46.79,16.92 46.94,16.92 47.7,16.15 47.7,15.24 53.34,9.6 57.61,9.6 57.91,9.91 68.89,9.91 71.02,7.77 82.14,7.77 84.12,9.75 84.12,11.73 85.04,12.65 MBR_CONNECTOR.4
N$23  (via drill 0.35)
  Top 0.152: v64.47,10.82 53.03,10.82 48.31,15.54 48.31,24.84 47.55,25.6 44.5,25.6 42.37,23.47 41.6,23.47 41.15,23.93 41.15,24.38 38.71,26.82 31.85,26.82 31.55,26.52 31.55,25.91 31.7,25.76 31.7,24.38 XOR_8-11.1
  Bottom 0.152: v64.47,10.82 64.92,10.82 66.14,9.6 71.93,9.6 72.69,8.84 87.63,8.84 88.09,9.3 88.09,11.73 87.17,12.65 MBR_CONNECTOR.2
N$24
  Top 0.152: XOR_4-7.3 59.89,24.23 51.05,33.07 51.05,33.22 48.46,35.81 46.33,35.81 44.96,37.19 ADDER_4-7.6
N$25
  Bottom 0.152: XOR_4-7.6 67.51,24.08 66.75,24.08 65.53,22.86 44.35,22.86 43.28,23.93 43.28,27.13 35.66,34.75 35.66,36.27 34.75,37.19 ADDER_4-7.2
N$26
  Top 0.152: XOR_4-7.8 69.95,32 68.73,32 67.82,31.09 62.18,31.09 57.15,36.12 46.94,36.12 46.02,37.03 46.02,37.64 39.93,43.74 35.81,43.74 34.75,44.81 ADDER_4-7.15
N$27
  Top 0.152: XOR_4-7.11 62.33,32.16 61.57,32.16 51.21,42.52 47.24,42.52 44.96,44.81 ADDER_4-7.11
N$28
  Bottom 0.152: ACCUMULATOR_CONNECTOR.2 70.1,86.26 70.1,80.01 72.54,77.57 72.54,58.67 73.15,58.06 73.15,51.36 74.22,50.29 ADDER_8-11.5
N$29
  Bottom 0.152: XOR_8-11.6 44.65,24.38 44.65,25.76 62.33,43.43 62.33,45.87 66.6,50.14 ADDER_8-11.2
N$30
  Bottom 0.152: XOR_8-11.8 47.09,32.31 50.75,32.31 62.03,43.59 62.03,46.02 65.53,49.53 65.53,56.69 66.6,57.76 ADDER_8-11.15
N$31
  Top 0.152: XOR_8-11.11 39.32,32.31 39.32,33.53 35.81,37.03 35.81,42.22 33.53,44.5 33.53,46.33 35.2,48.01 44.04,48.01 46.18,50.14 46.18,51.36 48.92,54.1 53.8,54.1 64.77,65.08 64.77,69.19 68.73,73.15 68.73,81.69 73.15,86.11 73.15,86.72 73.76,87.33 74.37,87.33 75.13,86.56 75.13,79.4 76.96,77.57 76.96,57.91 ADDER_8-11.11
N$32  (via drill 0.35)
  Top 0.152: v78.79,90.37 81.84,90.37 83.36,88.85 83.97,88.85 ACCUMULATOR_CONNECTOR.15 | v57.91,78.94 57.91,58.67 53.65,54.41 47.24,54.41 43.43,50.6 43.43,49.84 v42.52,48.92
  Bottom 0.152: v78.79,90.37 69.34,90.37 v57.91,78.94 | v42.52,48.92 42.52,47.4 42.37,47.24 42.37,44.96 ADDER_4-7.12
N$33  (via drill 0.35)
  Top 0.152: v41.15,55.32 v41.15,58.83
  Bottom 0.152: v41.15,58.83 41.91,59.59 41.91,71.93 45.72,75.74 45.87,75.74 61.72,91.59 82.75,91.59 85.04,89.31 85.04,85.95 84.43,85.34 83.67,85.34 83.06,85.95 83.06,87.02 82.14,87.94 82.14,88.7 ACCUMULATOR_CONNECTOR.13 | v41.15,55.32 41.15,51.21 40.84,50.9 40.84,48.46 37.34,44.96 ADDER_4-7.14
N$34
  Bottom 0.152: ACCUMULATOR_CONNECTOR.11 80.01,88.85 79.4,88.85 78.18,90.07 69.49,90.07 58.52,79.1 58.52,78.64 58.06,78.18 55.63,78.18 51.97,74.52 51.97,71.48 43.74,63.25 43.74,53.34 41.15,50.75 41.15,47.85 38.41,45.11 38.41,38.41 37.34,37.34 ADDER_4-7.3
N$35  (via drill 0.35)
  Top 0.152: v54.1,57.91 57.3,61.11 57.3,79.25 67.82,89.76 76.5,89.76 77.42,88.85 78.03,88.85 ACCUMULATOR_CONNECTOR.9
  Bottom 0.152: v54.1,57.91 51.36,55.17 51.36,48.01 48.46,45.11 48.46,43.43 42.37,37.34 ADDER_4-7.5
N$36
  Bottom 0.152: ACCUMULATOR_CONNECTOR.7 76.2,88.7 76.2,87.63 77.11,86.72 77.11,77.88 77.27,77.72 77.27,59.89 75.44,58.06 75.44,45.41 74.37,44.35 ADDER_0-3.12
N$37  (via drill 0.35)
  Top 0.152: v74.07,48.46 75.44,49.84 75.44,50.44 76.66,51.66 76.66,53.03 78.03,54.41 78.03,58.06 79.1,59.13 79.1,86.72 78.03,87.78 75.74,87.78 74.83,88.7 74.22,88.7 ACCUMULATOR_CONNECTOR.5
  Bottom 0.152: v74.07,48.46 72.85,48.46 69.34,44.96 69.34,44.35 ADDER_0-3.14
N$38
  Bottom 0.152: ACCUMULATOR_CONNECTOR.3 71.93,88.7 71.63,88.7 70.26,87.33 69.65,87.33 69.04,86.72 69.04,80.62 71.93,77.72 71.93,62.18 67.82,58.06 67.82,46.94 65.53,44.65 65.53,40.39 69.19,36.73 ADDER_0-3.3
N$39  (via drill 0.35)
  Top 0.152: v69.65,77.88 69.65,66.9 75.44,61.11 75.44,53.03 73.15,50.75 v73.15,47.85 | v73.15,39.17 73.15,37.8 74.22,36.73 ADDER_0-3.5
  Bottom 0.152: v69.65,77.88 68.73,78.79 68.73,86.87 69.95,88.09 69.95,88.7 ACCUMULATOR_CONNECTOR.1 | v73.15,39.17 v73.15,47.85
N$40  (via drill 0.35)
  Top 0.152: v68.73,24.08 68.73,28.96 75.74,35.97 v75.74,43.13
  Bottom 0.152: v68.73,24.08 66.6,21.95 65.99,21.95 65.68,22.25 40.23,22.25 38.25,24.23 37.03,24.23 XOR_8-11.3 | v75.74,43.13 75.74,49.07 76.81,50.14 ADDER_8-11.6
N$41  (via drill 0.35)
  Top 0.152: v73.15,58.98 73.15,54.1 69.34,50.29 ADDER_8-11.3
  Bottom 0.152: v73.15,58.98 73.15,77.42 72.08,78.49 72.08,86.26 ACCUMULATOR_CONNECTOR.4
N$42
  Top 0.152: ACCUMULATOR_CONNECTOR.6 74.07,86.26 74.07,83.21 69.04,78.18 69.04,58.06 69.19,57.91 ADDER_8-11.14
N$43
  Bottom 0.152: ACCUMULATOR_CONNECTOR.8 76.2,86.26 76.2,78.33 76.96,77.57 76.96,60.5 74.37,57.91 ADDER_8-11.12
N$44  (via drill 0.35)
  Top 0.152: v62.94,77.88 71.02,85.95 71.02,86.72 71.93,87.63 74.52,87.63 74.68,87.48 76.35,87.48 77.42,86.41 78.03,86.41 ACCUMULATOR_CONNECTOR.10
  Bottom 0.152: v62.94,77.88 60.81,75.74 60.66,75.74 57,72.08 57,71.48 48.77,63.25 48.77,55.47 49.84,54.41 49.84,53.19 48.46,51.82 43.74,51.82 42.37,50.44 ADDER_12-15.5
N$45
  Bottom 0.152: ACCUMULATOR_CONNECTOR.12 80.16,86.26 80.77,86.26 81.99,85.04 84.58,85.04 85.34,85.8 85.34,89.46 82.91,91.9 59.28,91.9 41.91,74.52 41.91,74.37 32.77,65.23 30.63,65.23 30.02,64.62 30.02,62.03 33.53,58.52 33.53,54.1 37.19,50.44 ADDER_12-15.3
N$46
  Bottom 0.152: ACCUMULATOR_CONNECTOR.14 81.99,86.41 81.99,87.63 81.08,88.54 81.08,89.15 79.25,90.98 65.99,90.98 46.94,71.93 46.94,66.9 43.43,63.4 43.43,57.61 42.67,56.84 38.41,56.84 37.34,57.91 ADDER_12-15.14
N$47
  Bottom 0.152: ACCUMULATOR_CONNECTOR.16 83.97,86.41 83.97,87.63 83.06,88.54 83.06,89.15 80.92,91.29 63.7,91.29 46.94,74.52 46.94,74.07 42.37,69.49 42.37,58.06 ADDER_12-15.12
N$48
  Bottom 0.152: XOR_12-15.6 20.12,24.23 20.12,30.94 30.63,41.45 30.63,46.33 34.59,50.29 ADDER_12-15.2
N$49
  Top 0.152: XOR_12-15.3 12.5,24.08 12.5,17.37 13.41,16.46 13.41,15.54 14.63,14.33 21.95,14.33 30.63,23.01 30.63,41.76 33.22,44.35 33.22,46.48 35.05,48.31 42.82,48.31 44.81,50.29 ADDER_12-15.6
N$50
  Top 0.152: XOR_12-15.8 22.71,32.16 22.71,46.02 34.59,57.91 ADDER_12-15.15
N$51
  Top 0.152: XOR_12-15.11 14.94,32.16 14.94,36.58 14.33,37.19 14.33,52.88 23.47,62.03 40.84,62.03 44.81,58.06 ADDER_12-15.11
N$52  (via drill 0.35)
  Top 0.152: C1.1 6.71,84.89 6.71,80.01 C2.1 6.71,79.86 6.71,75.13 C3.1 6.71,74.98 6.71,70.1 C4.1 6.86,69.95 12.65,64.16 12.65,60.05 BUS_CONNECTOR.20 | LED15.K 20.88,77.27 LED14.K 21.03,77.27 25.91,77.27 LED13.K 26.06,77.27 30.94,77.27 LED12.K 31.09,77.27 35.97,77.27 LED11.K 36.12,77.27 LED10.K 41.15,77.27 45.87,77.27 LED9.K 46.02,77.27 50.9,77.27 LED8.K 51.05,77.27 55.93,77.27 LED7.K | v51.97,48.31 49.99,50.29 ADDER_12-15.8 | LED3.K 75.89,77.27 71.02,77.27 LED4.K | LED6.K 61.11,77.27 LED5.K | v32.16,26.21 38.86,26.21 39.47,25.6 | 39.47,25.6 40.84,24.23 40.84,23.77 41.45,23.16 45.87,23.16 46.94,24.23 XOR_8-11.7 | 42.82,12.8 38.1,8.08 32.46,8.08 BUFFER_8-15.10 | 42.82,12.8 42.82,19.66 38.56,23.93 38.56,24.69 39.47,25.6 | 42.82,12.8 46.33,9.3 57.76,9.3 58.06,9.6 61.57,9.6 63.09,8.08 64.31,8.08 BUFFER_0-7.10 | LED2.K 81.08,77.27 85.95,77.27 LED1.K 86.11,77.27 90.98,77.27 LED0.K | ADDER_8-11.8 81.99,50.14 83.36,48.77 83.36,38.1 81.99,36.73 ADDER_0-3.8 | v77.11,31.24 70.1,24.23 XOR_4-7.7
  Bottom 0.152: v51.97,48.31 51.97,45.41 49.99,43.43 49.99,37.34 ADDER_4-7.8 | LED6.K 60.96,77.27 56.08,77.27 LED7.K | 66.9,77.27 70.87,77.27 LED4.K | 66.9,77.27 66.14,77.27 LED5.K | 66.9,77.27 66.9,63.7 66.45,63.25 58.67,63.25 56.69,65.23 55.78,65.23 53.19,62.64 53.19,57.91 50.75,55.47 50.75,52.27 49.99,51.51 49.99,50.44 ADDER_12-15.8 | C3.1 6.86,75.13 8.08,75.13 10.21,77.27 15.85,77.27 LED15.K | v32.16,26.21 30.18,24.23 22.71,24.23 XOR_12-15.7 | XOR_4-7.7 69.95,24.23 69.49,24.23 68.73,24.99 67.21,24.99 65.38,23.16 48.16,23.16 47.09,24.23 XOR_8-11.7 | XOR_0-3.7 92.96,24.54 92.96,28.65 85.04,36.58 81.99,36.58 ADDER_0-3.8 81.84,36.58 81.84,35.05 78.03,31.24 v77.11,31.24 | ADDER_8-11.8 81.99,50.29 83.06,51.36 83.06,74.07 81.08,76.05 81.08,77.27 LED2.K 80.92,77.42 79.1,79.25 79.1,86.72 78.49,87.33 78.18,87.33 77.11,88.39 77.11,89.15 76.5,89.76 75.59,89.76 75.13,89.31 75.13,85.95 75.89,85.19 75.89,77.42 LED3.K
N$53  (via drill 0.35)
  Top 0.152: v18.59,13.72 14.78,13.72 13.11,15.39 13.11,16.31 11.43,17.98 11.43,39.93 v11.73,40.23
  Bottom 0.152: v18.59,13.72 19.05,13.26 37.03,13.26 40.69,16.92 44.5,16.92 45.41,16 46.63,16 BUFFER_0-7.18 | v11.73,40.23 10.06,41.91 BUS_CONNECTOR.1
N$54  (via drill 0.35)
  Top 0.152: BUFFER_8-15.20 9.45,16 9.45,23.47 8.38,24.54 8.38,31.09 7.47,32 XOR_12-15.14 | C4.2 9.3,70.1 9.3,74.98 C3.2 9.3,75.13 9.3,79.86 C2.2 9.3,80.01 9.3,84.89 C1.2 | v61.42,44.35 64.01,44.35 ADDER_0-3.16 | BUFFER_0-7.20 41.45,16 38.25,16 30.94,23.32 30.94,31.39 31.7,32.16 XOR_8-11.14 | 35.81,54.71 35.81,49.53 32.16,45.87 32.16,44.96 ADDER_4-7.16 | 35.81,54.71 35.81,58.37 35.05,59.13 34.29,59.13 33.22,58.06 32.16,58.06 ADDER_12-15.16 | v53.34,55.02 53.03,55.02 52.73,54.71 35.81,54.71
  Bottom 0.152: 12.8,65.23 10.21,62.64 10.21,60.05 BUS_CONNECTOR.19 10.06,59.89 7.32,57.15 7.32,32.16 XOR_12-15.14 | 12.8,65.23 12.8,66.75 9.6,69.95 9.3,69.95 C4.2 | 63.4,41.45 64.01,42.06 64.01,44.2 ADDER_0-3.16 | 63.4,41.45 54.86,32.92 54.86,32.16 XOR_4-7.14 | 63.4,41.45 67.82,37.03 67.82,36.42 68.73,35.51 69.34,35.51 72.39,32.46 77.72,32.46 XOR_0-3.14 | 64.01,55.02 64.01,52.12 61.42,49.53 v61.42,44.35 | 64.01,55.02 64.01,57.76 ADDER_8-11.16 | XOR_8-11.14 31.7,32.31 31.7,35.66 30.94,36.42 30.94,40.84 32,41.91 32,44.81 ADDER_4-7.16 | v53.34,55.02 64.01,55.02 | 12.8,65.23 26.36,65.23 32,59.59 32,58.06 ADDER_12-15.16
N$55  (via drill 0.35)
  Top 0.152: v23.62,18.44 23.62,24.69 18.44,29.87 18.44,33.98 v14.94,37.49
  Bottom 0.152: v23.62,18.44 27.89,14.17 34.75,14.17 38.71,18.14 49.99,18.14 50.9,17.22 51.82,17.22 52.58,16.46 52.58,15.54 52.12,15.09 51.36,15.09 50.6,15.85 49.23,15.85 BUFFER_0-7.17 | v14.94,37.49 14.94,37.95 11.12,41.76 11.12,42.98 10.21,43.89 BUS_CONNECTOR.3
N$56  (via drill 0.35)
  Top 0.152: v18.44,26.21 v18.44,21.03
  Bottom 0.152: v18.44,21.03 25.6,13.87 34.9,13.87 38.86,17.83 49.84,17.83 51.66,16 BUFFER_0-7.16 | v18.44,26.21 16.61,28.04 16.61,43.43 13.11,46.94 11.12,46.94 10.21,46.02 BUS_CONNECTOR.5
N$57  (via drill 0.35)
  Top 0.152: v41.3,12.19 38.25,9.14 v33.22,9.14 | v9.3,37.34 9.3,41.6 9.14,41.76 9.14,46.94 10.06,47.85 BUS_CONNECTOR.7
  Bottom 0.152: v41.3,12.19 49.68,12.19 53.34,15.85 54.25,15.85 BUFFER_0-7.15 | v33.22,9.14 27.13,9.14 24.54,6.55 9.45,6.55 8.69,7.32 8.69,36.73 v9.3,37.34
N$58  (via drill 0.35)
  Top 0.152: v50.44,32.92 58.37,24.99 58.37,15.7 58.52,15.54 58.52,14.94 58.22,14.63 57.61,14.63 56.84,15.39 56.84,15.85 BUFFER_0-7.14 | v52.43,55.32 51.05,55.32 48.46,57.91 48.46,58.52 44.35,62.64 23.16,62.64 22.55,62.03 18.44,62.03 15.24,58.83 15.24,56.69 13.72,55.17 13.72,53.65 13.11,53.03 12.34,53.03 11.12,51.82 11.12,51.05 10.21,50.14 BUS_CONNECTOR.9
  Bottom 0.152: v50.44,32.92 50.44,36.27 52.58,38.41 52.58,55.17 v52.43,55.32
N$59  (via drill 0.35)
  Top 0.152: v60.05,8.99 42.37,8.99 v41.15,10.21 | v27.89,10.21 27.43,10.21 25.15,12.5 11.73,12.5 6.4,17.83 6.4,50.29 v8.23,52.12
  Bottom 0.152: v60.05,8.99 60.05,13.56 59.44,14.17 59.44,15.85 BUFFER_0-7.13 | v27.89,10.21 v41.15,10.21 | v8.23,52.12 10.06,52.12 BUS_CONNECTOR.11
N$60  (via drill 0.35)
  Top 0.152: v13.56,57 12.34,57 11.43,56.08 11.43,55.32 10.21,54.1 BUS_CONNECTOR.13
  Bottom 0.152: v13.56,57 30.02,57 36.12,50.9 36.12,44.81 33.53,42.22 33.53,36.88 35.36,35.05 35.36,24.69 38.1,21.95 47.09,21.95 51.21,17.83 59.74,17.83 61.57,16 61.87,16 BUFFER_0-7.12
N$61  (via drill 0.35)
  Top 0.152: v58.67,13.11 60.35,13.11 63.09,15.85 64.31,15.85 BUFFER_0-7.11
  Bottom 0.152: v58.67,13.11 58.67,12.8 56.39,10.52 56.39,9.75 57.76,8.38 57.76,7.77 57.15,7.16 56.39,7.16 53.95,9.6 35.2,9.6 31.85,6.25 9.3,6.25 8.38,7.16 8.38,51.05 7.62,51.82 7.62,53.49 10.06,55.93 BUS_CONNECTOR.15
N$62  (via drill 0.35)
  Top 0.152: v18.44,27.13 22.25,23.32 22.25,16 BUFFER_8-15.15
  Bottom 0.152: v18.44,27.13 18.44,42.22 12.8,47.85 BUS_CONNECTOR.8
N$63
  Bottom 0.152: BUFFER_8-15.16 19.66,15.85 18.29,15.85 17.53,15.09 16.76,15.09 16.31,15.54 16.31,23.77 16,24.08 16,37.34 11.73,41.6 11.73,44.96 12.65,45.87 BUS_CONNECTOR.6
N$64
  Bottom 0.152: BUFFER_8-15.11 32.31,15.85 31.55,15.85 30.79,15.09 29.57,15.09 28.96,15.7 28.96,19.2 32.77,23.01 32.77,30.02 30.63,32.16 30.63,41 30.94,41.3 30.94,45.26 34.9,49.23 35.05,49.23 35.81,49.99 35.81,50.75 30.63,55.93 12.8,55.93 BUS_CONNECTOR.16
N$65  (via drill 0.35)
  Top 0.152: v28.65,22.55 28.65,24.84 14.94,38.56 v14.94,51.82
  Bottom 0.152: v28.65,22.55 28.65,15.54 29.41,14.78 32.46,14.78 33.38,15.7 33.38,16.31 32.77,16.92 32.16,16.92 31.24,16 30.02,16 BUFFER_8-15.12 | v14.94,51.82 12.8,53.95 BUS_CONNECTOR.14
N$66
  Top 0.152: BUFFER_8-15.13 27.28,15.85 25.91,15.85 23.16,13.11 13.72,13.11 11.12,15.7 11.12,50.44 12.65,51.97 BUS_CONNECTOR.12
N$67  (via drill 0.35)
  Top 0.152: v17.68,23.01 17.37,23.32 17.22,23.32 14.02,26.52 14.02,48.77 12.8,49.99 BUS_CONNECTOR.10
  Bottom 0.152: v17.68,23.01 24.69,16 BUFFER_8-15.14
N$68
  Bottom 0.152: BUFFER_8-15.17 17.07,16 17.07,23.47 16.31,24.23 16.31,40.39 12.8,43.89 BUS_CONNECTOR.4
N$69
  Top 0.152: BUFFER_8-15.18 14.63,16 14.63,23.32 13.72,24.23 13.72,41 12.8,41.91 BUS_CONNECTOR.2
N$70  (via drill 0.35)
  Top 0.152: 31.55,7.16 29.41,7.16 28.35,8.23 28.35,8.38 27.74,8.99 19.36,8.99 17.53,7.16 10.36,7.16 9.6,7.92 BUFFER_8-15.1 9.45,8.08 4.57,12.95 4.57,51.66 10.06,57.15 10.06,57.91 BUS_CONNECTOR.17 | 31.55,7.16 37.64,7.16 38.41,7.92 41.45,7.92 BUFFER_0-7.1 | v40.39,12.19 35.36,12.19 31.55,8.38 31.55,7.16
  Bottom 0.152: BUFFER_8-15.1 9.6,8.08 9.6,13.41 12.04,15.85 BUFFER_8-15.19 | v40.39,12.19 44.04,15.85 BUFFER_0-7.19
N$71  (via drill 0.35)
  Top 0.152: BUFFER_0-7.2 44.2,7.92 45.41,7.92 46.48,6.86 86.11,6.86 94.03,14.78 94.03,61.27 91.14,64.16 R0.2 | v80.47,37.95 80.47,41.15 83.06,43.74 83.06,48.16 v82.75,48.46
  Bottom 0.152: v80.47,37.95 74.07,37.95 72.85,36.73 71.78,36.73 ADDER_0-3.4 | v82.75,48.46 82.75,49.53 90.98,57.76 90.98,64.16 R0.2
N$72  (via drill 0.35)
  Top 0.152: BUS_CONNECTOR.18 12.65,57.91 11.12,56.39 11.12,55.63 10.52,55.02 9.91,55.02 8.84,53.95 8.84,37.8 8.69,37.64 8.69,33.38 9.91,32.16 XOR_12-15.13 10.06,32 10.06,24.23 XOR_12-15.2 10.06,24.08 10.06,16.76 10.82,16 10.82,15.54 13.56,12.8 39.62,12.8 42.52,15.7 42.52,16.31 34.44,24.38 XOR_8-11.2 34.29,24.23 33.22,23.16 v32,23.16 | 42.06,31.39 42.06,32.16 XOR_8-11.10 42.06,32.31 42.82,32.31 45.72,35.2 46.33,35.2 57.3,24.23 XOR_4-7.2 | 42.06,31.39 42.06,24.38 XOR_8-11.5 | XOR_12-15.5 17.68,24.23 17.68,32 XOR_12-15.10 | 42.06,31.39 35.2,31.39 34.44,32.16 XOR_8-11.13 | XOR_0-3.13 80.31,32.46 80.31,35.66 79.4,36.58 ADDER_0-3.7 | XOR_0-3.5 88.09,24.54 88.09,28.65 91.44,32 91.44,32.77 90.83,33.38 89,33.38 88.09,32.46 XOR_0-3.10 | XOR_4-7.5 65.08,24.08 66.29,24.08 67.21,23.16 79.1,23.16 80.31,24.38 XOR_0-3.2
  Bottom 0.152: XOR_8-11.2 34.44,24.38 34.44,32.16 XOR_8-11.13 | v32,23.16 19.81,23.16 18.9,24.08 17.68,24.08 XOR_12-15.5 | 57.45,28.19 57.45,32 XOR_4-7.13 | 57.45,28.19 57.45,24.23 XOR_4-7.2 | 65.08,28.19 65.08,32 XOR_4-7.10 | 65.08,28.19 65.08,24.23 XOR_4-7.5 | 65.08,28.19 57.45,28.19 | XOR_0-3.2 80.47,24.54 81.69,24.54 82.45,25.3 87.17,25.3 87.94,24.54 XOR_0-3.5 | XOR_0-3.10 87.94,32.46 86.72,32.46 85.8,33.38 81.38,33.38 80.47,32.46 XOR_0-3.13
N$73  (via drill 0.35)
  Top 0.152: v92.35,25.45 92.2,25.6 92.2,53.49 86.11,59.59 86.11,64.16 R1.2
  Bottom 0.152: 85.34,18.14 78.79,24.69 78.79,25.15 69.04,34.9 65.84,34.9 64.16,36.58 ADDER_0-3.1 | 85.34,18.14 88.7,14.78 88.7,8.99 85.95,6.25 54.25,6.25 53.03,7.47 53.03,7.92 51.97,8.99 48.92,8.99 48.01,8.08 46.79,8.08 BUFFER_0-7.3 | v92.35,25.45 92.35,24.99 85.5,18.14 85.34,18.14
N$74
  Top 0.152: 87.63,57.61 81.08,64.16 R2.2 | 87.63,57.61 91.75,53.49 91.75,12.95 85.95,7.16 51.36,7.16 50.6,7.92 49.23,7.92 BUFFER_0-7.4 | 87.63,57.61 80.77,50.75 80.77,49.99 77.42,46.63 75.13,46.63 72.85,44.35 71.78,44.35 ADDER_0-3.13
N$75  (via drill 0.35)
  Top 0.152: v76.05,52.58 75.74,52.88 75.74,58.37 75.89,58.52 75.89,64.16 R3.2
  Bottom 0.152: BUFFER_0-7.5 51.82,7.92 52.12,7.92 54.1,5.94 86.11,5.94 94.03,13.87 94.03,32.77 83.67,43.13 80.47,43.13 79.4,44.2 ADDER_0-3.10 79.25,44.35 78.18,45.41 78.18,50.44 v76.05,52.58
N$76  (via drill 0.35)
  Top 0.152: v57,10.21 53.19,10.21 48.01,15.39 48.01,24.69 47.4,25.3 46.79,25.3 v45.72,24.23 | v67.06,48.77 67.82,49.53 67.82,50.44 72.85,55.47 72.85,58.37 71.02,60.2 71.02,64.16 R4.2
  Bottom 0.152: v57,10.21 58.06,9.14 58.06,7.62 57.3,6.86 56.24,6.86 55.17,7.92 54.41,7.92 BUFFER_0-7.6 | ADDER_4-7.4 39.78,37.19 43.59,33.38 43.59,24.08 44.2,23.47 44.96,23.47 v45.72,24.23 62.64,41.15 62.64,44.35 v67.06,48.77
N$77  (via drill 0.35)
  Top 0.152: v50.44,10.97 43.43,17.98 v43.43,19.05 | v35.05,46.94 v42.98,46.94
  Bottom 0.152: v50.44,10.97 53.03,10.97 55.93,8.08 56.69,8.08 BUFFER_0-7.7 | v43.43,19.05 38.41,19.05 33.07,24.38 33.07,36.27 32.16,37.19 ADDER_4-7.1 32.16,37.34 33.22,38.41 33.22,45.11 v35.05,46.94 | v42.98,46.94 46.02,49.99 46.02,50.6 46.94,51.51 48.62,51.51 50.14,53.03 50.14,55.78 51.05,56.69 51.05,61.42 55.47,65.84 60.66,65.84 62.18,64.31 65.99,64.31 R5.2
N$78  (via drill 0.35)
  Top 0.152: v57.91,15.24 57.91,22.25 55.78,24.38 55.78,24.84 v46.02,34.59
  Bottom 0.152: v57.91,15.24 59.28,13.87 59.28,8.08 BUFFER_0-7.8 | v46.02,34.59 43.43,34.59 40.84,37.19 40.84,43.74 | 40.84,43.74 39.78,44.81 ADDER_4-7.13 | 40.84,43.74 42.67,43.74 43.43,44.5 43.43,45.11 44.35,46.02 44.65,46.02 48.46,49.84 48.46,50.44 50.44,52.43 50.44,55.63 51.36,56.54 51.36,61.27 55.63,65.53 56.84,65.53 58.06,64.31 60.96,64.31 R6.2
N$79  (via drill 0.35)
  Top 0.152: v71.63,8.99 77.27,8.99 78.03,9.75 78.03,10.67 76.96,11.73 76.66,11.73 76.05,12.34 76.05,13.11 67.21,21.95 65.84,21.95 64.16,23.62 64.16,24.84 71.02,31.7 71.02,32.46 67.97,35.51 58.67,35.51 51.36,42.82 49.38,42.82 47.4,44.81 ADDER_4-7.10
  Bottom 0.152: v71.63,8.99 64.16,8.99 63.25,8.08 62.03,8.08 BUFFER_0-7.9 | R7.2 55.93,64.16 55.93,62.64 53.49,60.2 53.49,57.76 51.05,55.32 51.05,48.62 47.4,44.96 ADDER_4-7.10
N$80  (via drill 0.35)
  Top 0.152: v5.18,14.94 12.04,8.08 BUFFER_8-15.2 | v11.28,66.45 11.89,67.06 48.16,67.06 50.9,64.31 R8.2 | v65.38,65.38 65.08,65.08 65.08,63.86 65.23,63.7 65.23,49.68 66.75,48.16 68.73,48.16 70.71,50.14 71.63,50.14 ADDER_8-11.4
  Bottom 0.152: v5.18,14.94 5.18,60.35 v11.28,66.45 | v65.38,65.38 61.57,65.38 60.81,66.14 52.88,66.14 51.05,64.31 R8.2
N$81  (via drill 0.35)
  Top 0.152: v5.79,51.97 5.79,16.15 13.87,8.08 14.63,8.08 BUFFER_8-15.3 | v12.19,66.45 43.74,66.45 45.87,64.31 R9.2 | v49.23,53.49 52.43,50.29 64.01,50.29 ADDER_8-11.1
  Bottom 0.152: v5.79,51.97 5.79,60.05 v12.19,66.45 | v49.23,53.49 49.23,54.56 46.02,57.76 46.02,64.16 R9.2
N$82  (via drill 0.35)
  Top 0.152: v6.4,16.46 10.97,11.89 12.04,11.89 15.85,8.08 17.07,8.08 BUFFER_8-15.4 | v12.19,65.53 39.78,65.53 41,64.31 R10.2 41.15,64.16 43.74,64.16 47.09,60.81 v55.02,60.81 | v69.65,60.81 71.63,58.83 71.63,57.91 ADDER_8-11.13
  Bottom 0.152: v6.4,16.46 6.4,59.74 v12.19,65.53 | v55.02,60.81 v69.65,60.81
N$83  (via drill 0.35)
  Top 0.152: v12.04,37.49 12.04,39.62 12.34,39.93 12.34,41 11.73,41.6 11.73,50.44 12.34,51.05 13.11,51.05 14.02,51.97 14.02,55.02 v19.81,60.81 | v21.64,62.64 22.71,62.64 23.01,62.94 34.75,62.94 35.97,64.16 R11.2 36.12,64.16 37.03,63.25 44.2,63.25 47.24,60.2 55.32,60.2 57,61.87 57,79.4 67.67,90.07 78.18,90.07 79.1,89.15 79.1,88.39 79.7,87.78 80.01,87.78 81.08,86.72 81.08,85.95 79.4,84.28 79.4,57.91 ADDER_8-11.10
  Bottom 0.152: v12.04,37.49 11.58,37.03 11.58,23.77 13.11,22.25 13.11,10.82 17.07,6.86 22.4,6.86 23.16,7.62 23.16,8.38 22.55,8.99 21.49,8.99 20.57,8.08 19.81,8.08 BUFFER_8-15.5 | v21.64,62.64 v19.81,60.81
N$84  (via drill 0.35)
  Top 0.152: v11.12,53.19 11.12,53.8 12.34,55.02 13.11,55.02 14.94,56.84 14.94,58.98 19.2,63.25 30.02,63.25 30.94,64.16 R12.2
  Bottom 0.152: v11.12,53.19 11.12,51.51 10.67,51.05 9.91,51.05 8.84,49.99 8.84,41.6 13.41,37.03 13.41,13.11 19.36,7.16 20.12,7.16 20.88,7.92 22.25,7.92 BUFFER_8-15.6 | ADDER_12-15.4 39.62,50.44 39.62,53.95 35.81,57.76 35.81,59.44 31.09,64.16 R12.2
N$85
  Bottom 0.152: 12.19,48.92 12.34,49.07 30.79,49.07 32,50.29 ADDER_12-15.1 | 12.19,48.92 11.73,48.46 11.73,48.16 10.67,47.09 9.91,47.09 9.14,46.33 9.14,41.76 13.72,37.19 13.72,15.7 17.53,11.89 20.12,11.89 23.93,8.08 24.69,8.08 BUFFER_8-15.7 | 12.19,48.92 11.73,49.38 11.73,58.37 12.34,58.98 22.25,58.98 25.91,62.64 25.91,64.16 R13.2
N$86  (via drill 0.35)
  Top 0.152: v8.23,53.19 6.1,51.05 6.1,17.68 11.58,12.19 24.99,12.19 29.11,8.08 29.87,8.08 BUFFER_8-15.9 | v18.75,61.42 22.4,61.42 23.32,62.33 42.06,62.33 46.33,58.06 47.24,58.06 ADDER_12-15.10
  Bottom 0.152: v8.23,53.19 9.14,54.1 9.14,54.25 9.91,55.02 10.52,55.02 11.43,55.93 11.43,60.05 15.54,64.16 15.85,64.16 R16.2 16,64.16 v18.75,61.42
N$87
  Top 0.152: R16.1 16,71.93 16,74.68 LED15.A
N$88  (via drill 0.35)
  Top 0.152: BUFFER_8-15.8 27.28,7.92 25.91,7.92 24.84,6.86 9.14,6.86 4.27,11.73 4.27,53.49 9.75,58.98 14.48,58.98 19.66,64.16 20.88,64.16 R14.2 | v23.77,61.42 35.36,61.42 38.71,58.06 39.62,58.06 ADDER_12-15.13
  Bottom 0.152: v23.77,61.42 21.03,64.16 R14.2
N$89
  Top 0.152: R14.1 21.03,71.93 21.03,74.68 LED14.A
N$90
  Top 0.152: R13.1 26.06,71.93 26.06,74.68 LED13.A
N$91
  Top 0.152: R12.1 31.09,71.93 31.09,74.68 LED12.A
N$92
  Top 0.152: R11.1 35.97,71.93 35.97,74.68 LED11.A
N$93
  Top 0.152: R10.1 41,71.93 41,74.68 LED10.A
N$94
  Top 0.152: R9.1 46.02,71.93 46.02,74.68 LED9.A
N$95
  Top 0.152: R8.1 51.05,71.93 51.05,74.68 LED8.A
N$96
  Top 0.152: R7.1 56.08,71.93 56.08,74.68 LED7.A
N$97
  Top 0.152: R6.1 60.96,71.93 60.96,74.68 LED6.A
N$98
  Top 0.152: R5.1 65.99,71.93 65.99,74.68 LED5.A
N$99
  Top 0.152: R4.1 71.02,71.93 71.02,74.68 LED4.A
N$100
  Top 0.152: R3.1 76.05,71.93 76.05,74.68 LED3.A
N$101
  Top 0.152: R2.1 81.08,71.93 81.08,74.68 LED2.A
N$102
  Top 0.152: R1.1 85.95,71.93 85.95,74.68 LED1.A
N$103
  Top 0.152: R0.1 90.98,71.93 90.98,74.68 LED0.A

### Text on the board
bNames: MARIE PC: / ALU / Architecture design by: Dr. Linda Null / Hardware implementation by: Richard Bowser